# Altium project SingleChip-Rev2.PrjPcb (part 2 of 8)

## Sheet AWR2243_PMIC.SchDoc: =ProjectTitle
size A3; PageSetup: Record=PageOptions|CenterHorizontal=True|CenterVertical=True|PrintScale=1.00|XCorrection=1.00|YCorrection=1.00|PrintKind=0|BorderSize=5000000|LeftOffset=0|BottomOffset=0|Orientation=2|PaperLength=1000|PaperWidth=1000|Scale=100|PaperSource=15|PrintQuality=600|MediaType=1|DitherType=10|PaperKind=Letter|PrintScaleMode=1; Author: Jaime I. Chait; Organization: NWES LLC; Address1: 111 SW 5th Ave, STE 3150; Address2: Portland, OR 97204; DocumentNumber: SCH-0001; Revision: 2; SheetNumber: 9; SheetTotal: 19
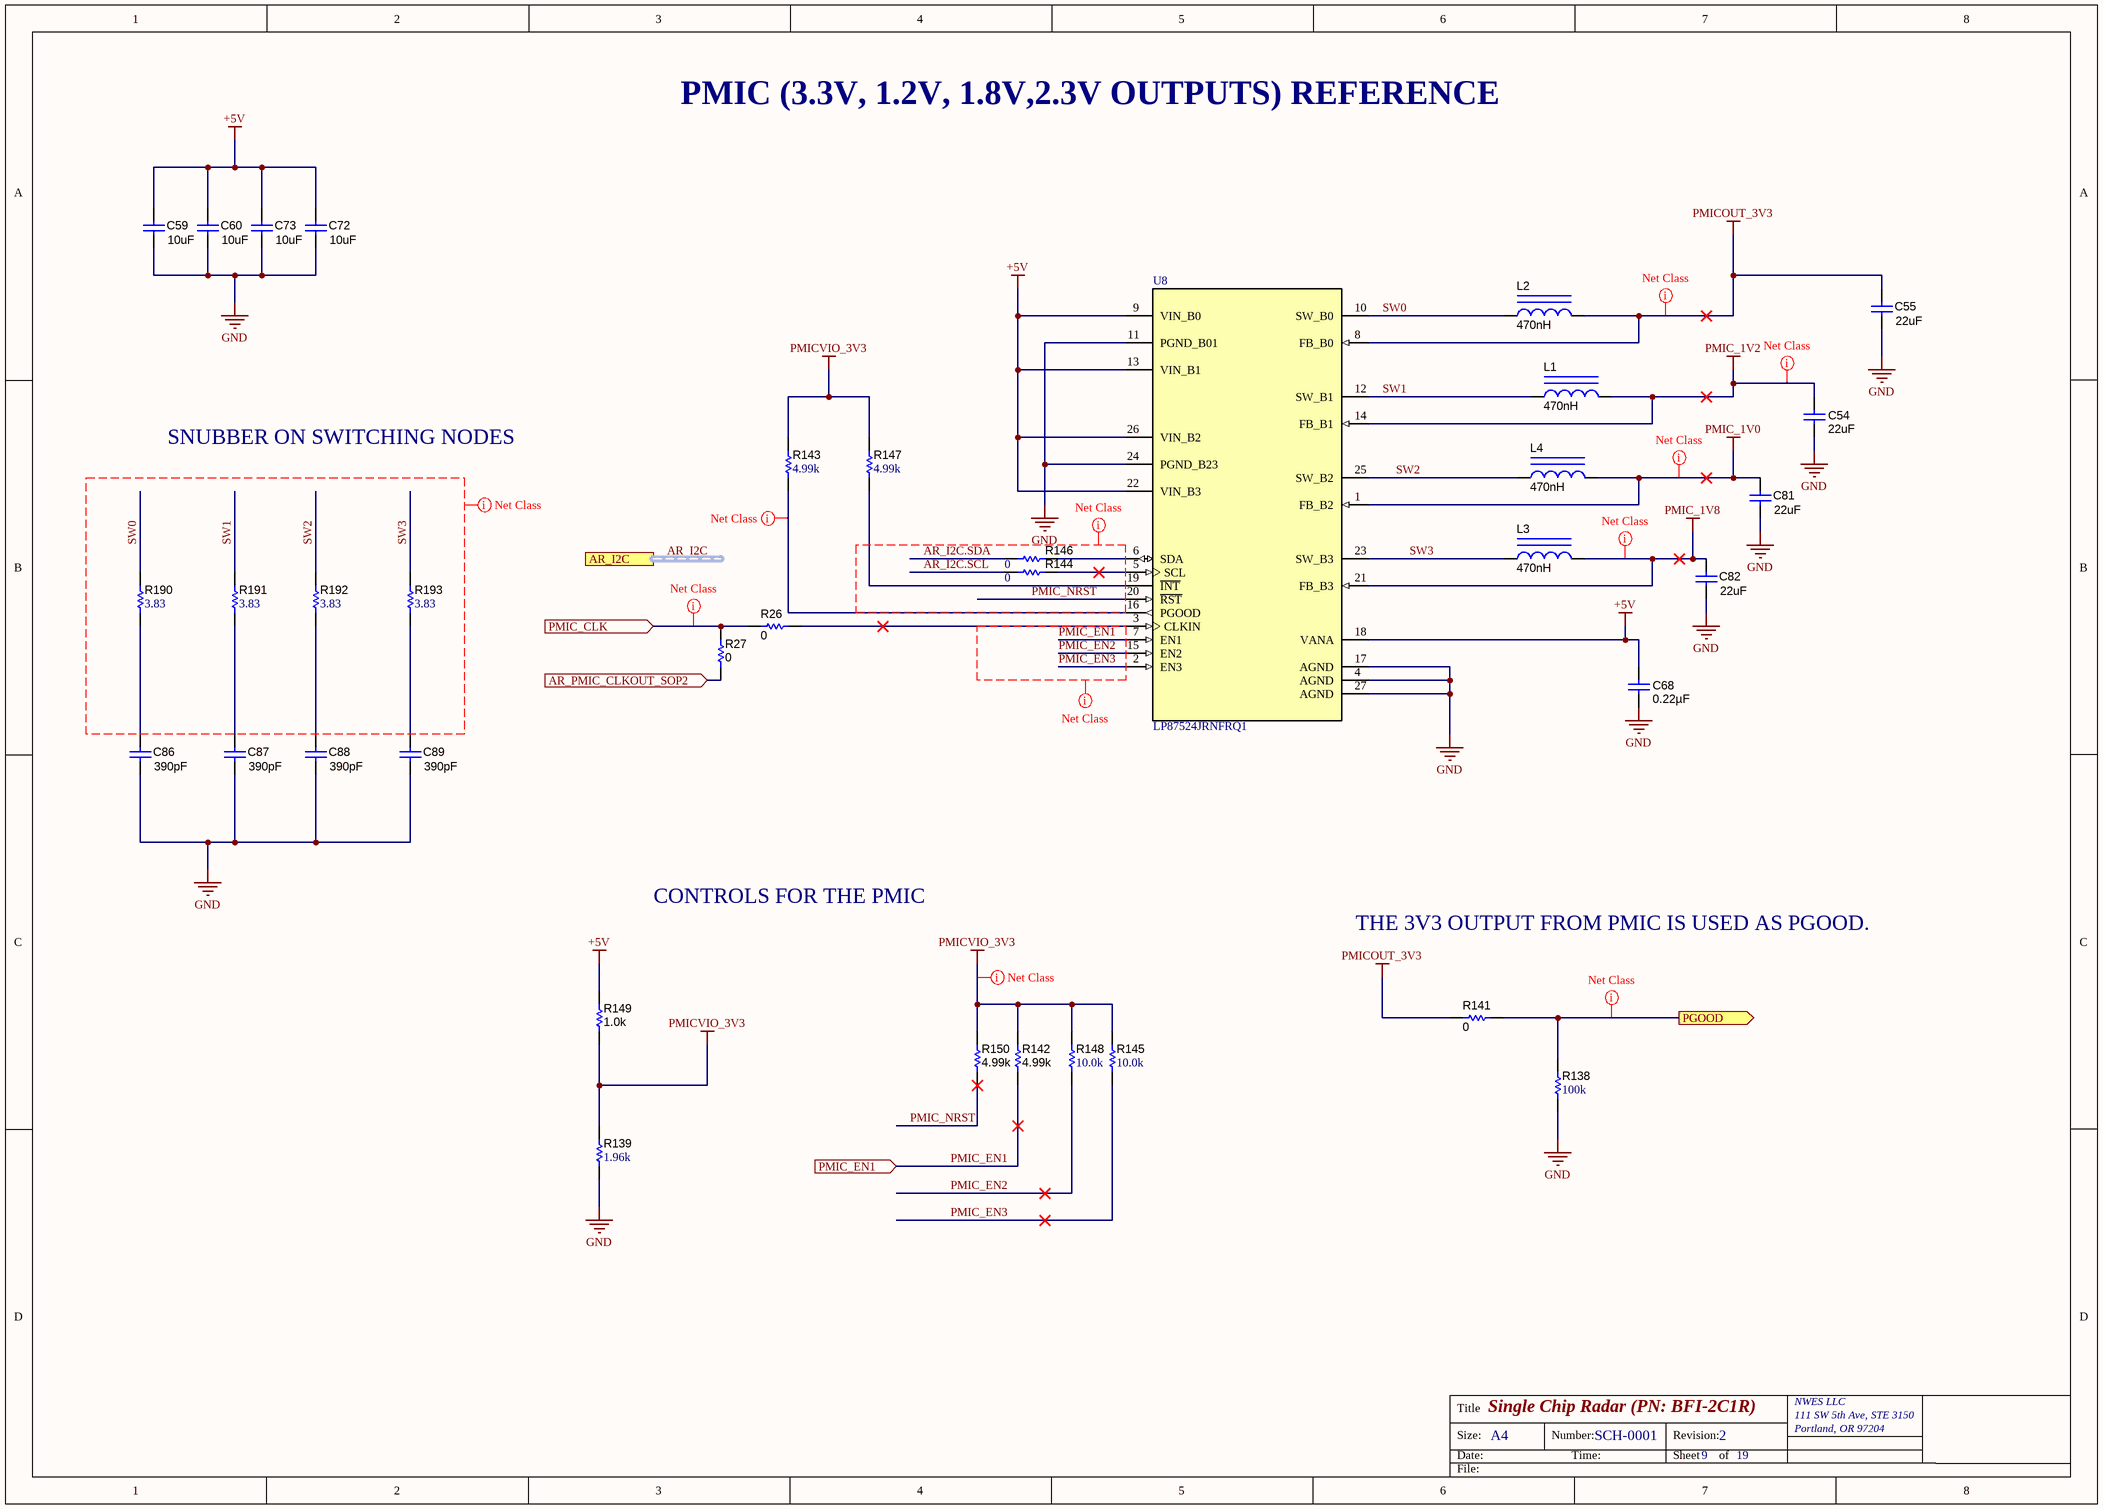
[diagram p6: AWR2243_PMIC.SchDoc]

### Parts
C54  ValueDisplayed: 22uF  [1206_180]  (hidden comment: GCM31CR71A226KE02)
C55  ValueDisplayed: 22uF  [1206_180]  (hidden comment: GCM31CR71A226KE02)
C59  ValueDisplayed: 10uF  [0805_HV1]  (hidden comment: GCM21BR71A106KE22L)
C60  ValueDisplayed: 10uF  [0805_HV1]  (hidden comment: GCM21BR71A106KE22L)
C68  ValueDisplayed: 0.22µF  [0402L]  (hidden comment: GCM155R71C224KE02D)
C72  ValueDisplayed: 10uF  [0805_HV1]  (hidden comment: GCM21BR71A106KE22L)
C73  ValueDisplayed: 10uF  [0805_HV1]  (hidden comment: GCM21BR71A106KE22L)
C81  ValueDisplayed: 22uF  [1206_180]  (hidden comment: GCM31CR71A226KE02)
C82  ValueDisplayed: 22uF  [1206_180]  (hidden comment: GCM31CR71A226KE02)
C86  ValueDisplayed: 390pF  [0402]  (hidden comment: GRM1555C1H391JA01D)
C87  ValueDisplayed: 390pF  [0402]  (hidden comment: GRM1555C1H391JA01D)
C88  ValueDisplayed: 390pF  [0402]  (hidden comment: GRM1555C1H391JA01D)
C89  ValueDisplayed: 390pF  [0402]  (hidden comment: GRM1555C1H391JA01D)
L1  ValueDisplayed: 470nH  [DFE252012P]  (hidden comment: DFE252012P-R47M=P2)
L2  ValueDisplayed: 470nH  [DFE252012P]  (hidden comment: DFE252012P-R47M=P2)
L3  ValueDisplayed: 470nH  [DFE252012P]  (hidden comment: DFE252012P-R47M=P2)
L4  ValueDisplayed: 470nH  [DFE252012P]  (hidden comment: DFE252012P-R47M=P2)
R26  ValueDisplayed: 0  [0402]  (hidden comment: ERJ-2GE0R00X)
R27  ValueDisplayed: 0  [0402]  (hidden comment: ERJ-2GE0R00X)
R138  ValueDisplayed: 100k  [0402L]  (hidden comment: CRCW0402100KFKED)
R139  ValueDisplayed: 1.96k  [0402L]  (hidden comment: CRCW04021K96FKED)
R141  ValueDisplayed: 0  [0402L]  (hidden comment: ERJ-2GE0R00X)
R142  ValueDisplayed: 4.99k  [0402L]  (hidden comment: ERJ-2RKF4991X)
R143  ValueDisplayed: 4.99k  [0402L]  (hidden comment: CRCW04024K99FKED)
R144  ValueDisplayed: 0  [0201_Silk]  (hidden comment: CRCW02010000Z0ED)
R145  ValueDisplayed: 10.0k  [0402L]  (hidden comment: CRCW040210K0FKED)
R146  ValueDisplayed: 0  [0201_Silk]  (hidden comment: CRCW02010000Z0ED)
R147  ValueDisplayed: 4.99k  [0402L]  (hidden comment: CRCW04024K99FKED)
R148  ValueDisplayed: 10.0k  [0402L]  (hidden comment: CRCW040210K0FKED)
R149  ValueDisplayed: 1.0k  [0402L]  (hidden comment: ERJ-2GEJ102X)
R150  ValueDisplayed: 4.99k  [0402L]  (hidden comment: ERJ-2RKF4991X)
R190  ValueDisplayed: 3.83  [0402L]  (hidden comment: CRCW04023R83FKED)
R191  ValueDisplayed: 3.83  [0402L]  (hidden comment: CRCW04023R83FKED)
R192  ValueDisplayed: 3.83  [0402L]  (hidden comment: CRCW04023R83FKED)
R193  ValueDisplayed: 3.83  [0402L]  (hidden comment: CRCW04023R83FKED)
U8  LP87524JRNFRQ1  [RNF0026C]

### Ports
AR_I2C (harness I2C), AR_PMIC_CLKOUT_SOP2 (in), PGOOD (out), PMIC_CLK (in), PMIC_EN1 (in)

### Nets
+5V: C59.2 C60.2 C68.2 C72.2 C73.2 R149.2 U8.9(VIN_B0) U8.13(VIN_B1) U8.18(VANA) U8.22(VIN_B3) U8.26(VIN_B2)
GND: C54.1 C55.1 C59.1 C60.1 C68.1 C72.1 C73.1 C81.1 C82.1 C86.2 C87.2 C88.2 C89.2 R138.1 R139.1 U8.4(AGND) U8.11(PGND_B01) U8.17(AGND) U8.24(PGND_B23) U8.27(AGND)
PMIC_1V0: C81.2 L4.2 U8.1(FB_B2)
PMIC_1V2: C54.2 L1.2 U8.14(FB_B1)
PMIC_1V8: C82.2 L3.2 U8.21(FB_B3)
PMICOUT_3V3: C55.2 L2.2 R141.1 U8.8(FB_B0)
PMICVIO_3V3: R139.2 R142.2 R143.2 R145.2 R147.2 R148.2 R149.1 R150.1
AR_I2C.SCL: R144.1
AR_I2C.SDA: R146.2
AR_PMIC_CLKOUT_SOP2: R27.2 ; port AR_PMIC_CLKOUT_SOP2
PGOOD: R138.2 R141.2 ; port PGOOD
PMIC_CLK: R26.1 R27.1 ; port PMIC_CLK
PMIC_EN1: R142.1 U8.7(EN1) ; port PMIC_EN1
PMIC_EN2: R148.1 U8.15(EN2)
PMIC_EN3: R145.1 U8.2(EN3)
PMIC_NRST: R150.2 U8.20(~{RST})
SW0: L2.1 R190.2 U8.10(SW_B0)
SW1: L1.1 R191.2 U8.12(SW_B1)
SW2: L4.1 R192.2 U8.25(SW_B2)
SW3: L3.1 R193.2 U8.23(SW_B3)
NetC86_1: C86.1 R190.1
NetC87_1: C87.1 R191.1
NetC88_1: C88.1 R192.1
NetC89_1: C89.1 R193.1
NetR26_2: R26.2 U8.3(CLKIN)
NetR143_1: R143.1 U8.16(PGOOD)
NetR144_2: R144.2 U8.5(SCL)
NetR146_1: R146.1 U8.6(SDA)
NetR147_1: R147.1 U8.19(~{INT})

### Buses and harness runs
harness AR_I2C = port AR_I2C

### Layout directives
net class PWR: PGOOD, PMIC_1V0, PMIC_1V2, PMIC_1V8, PMICOUT_3V3, PMICVIO_3V3
net class GENERAL: AR_I2C.SCL, AR_I2C.SDA, NetR143_1, PMIC_EN1, PMIC_EN2, PMIC_EN3, PMIC_NRST, SW0, SW1, SW2, SW3
net class CLK: PMIC_CLK

### Notes on the sheet
- PMIC (3.3V, 1.2V, 1.8V,2.3V OUTPUTS) REFERENCE
- SNUBBER ON SWITCHING NODES
- CONTROLS FOR THE PMIC
- THE 3V3 OUTPUT FROM PMIC IS USED AS PGOOD.
- Title
- Size:
- Date:
- A4
- Number:
- Time:
- Revision:
- Sheet
- of
- File:

### Library data of the parts
C54 = CMP-0008811-2: CAP, CERM, 22 uF, 10 V, +/- 10%, X7R, AEC-Q200 Grade 1, 1206; Manufacturer: MuRata; TaMin_C: -55°C; Polarized: N; SizeAreaWB_mm2: 10.92; Value1: Unknown; U/M: EA; Value: 22uF; TaMax_C: 125°C; SizeZ_mm: 1.8; SizeX_mm: 3.2; SizeY_mm: 1.6; Cap_Case: 1206; Value2: 10V; SizeArea_mm2: 5.12; CompType: Capacitor; AEC Qualified: Y; Cap_F: 22µF; AEC Grade: 1; AEC Category: Q200; Publisher: Texas Instruments; TempCo: X7R; Published: 2008-06-19; RoHS: Y; MountType: SMT; PackageReference: 1206; Tolerance_%: 10%; LatestRevisionDate: 2017-03-09; PartNumber: GCM31CR71A226KE02; VDC_V: 10V; ComponentLink1Description: Datasheet link; Technology: Ceramic; ComponentLink1URL: http://psearch.en.murata.com/capacitor/product/GCM31CR71A226KE02%23.pdf
C55 C81 C82 = CMP-0008811-2: CAP, CERM, 22 uF, 10 V, +/- 10%, X7R, AEC-Q200 Grade 1, 1206; Manufacturer: MuRata; TaMin_C: -55°C; Polarized: N; SizeAreaWB_mm2: 10.92; Value1: Unknown; U/M: EA; Value: 22uF; TaMax_C: 125°C; SizeZ_mm: 1.8; SizeX_mm: 3.2; SizeY_mm: 1.6; Cap_Case: 1206; Value2: 10V; SizeArea_mm2: 5.12; AEC Qualified: Y; Cap_F: 22µF; AEC Grade: 1; AEC Category: Q200; Publisher: Texas Instruments; TempCo: X7R; Published: 2008-06-19; RoHS: Y; MountType: SMT; PackageReference: 1206; Tolerance_%: 10%; CompType: Capacitor; LatestRevisionDate: 2017-03-09; PartNumber: GCM31CR71A226KE02; VDC_V: 10V; ComponentLink1Description: Datasheet link; Technology: Ceramic; ComponentLink1URL: http://psearch.en.murata.com/capacitor/product/GCM31CR71A226KE02%23.pdf
C59 C60 C72 C73 = CMP-0008017-2: CAP, CERM, 10 uF, 10 V, +/- 10%, X7R, 0805; Manufacturer: MuRata; TaMin_C: -55°C; Polarized: N; SizeAreaWB_mm2: 6.75; Value1: Unknown; U/M: EA; Value: 10uF; TaMax_C: 125°C; SizeZ_mm: 1.45; SizeX_mm: 2; SizeY_mm: 1.25; Cap_Case: 0805; Value2: 10V; SizeArea_mm2: 2.5; CompType: Capacitor; Cap_F: 10µF; AEC Category: Q200; Supplier Part Number 2: 06AC6014; Publisher: Texas Instruments; Supplier 2: Newark; Supplier Part Number 3: 81-GCM21BR71A106KE2L; TempCo: X7R; Supplier 3: Mouser; Published: 2008-06-19; RoHS: Y; MountType: SMT; Supplier 1: Digi-Key; PackageReference: 0805; Tolerance_%: 10%; LatestRevisionDate: 2017-03-09; PartNumber: GCM21BR71A106KE22L; AEC Qualified: ?; VDC_V: 10V; ComponentLink1Description: Datasheet link; Supplier Part Number 1: 490-10674-1-ND; Technology: Ceramic; ComponentLink1URL: http://www.murata.com/products/catalog/pdf/c03e.pdf
C68 = CMP-0078265-1: CAP, CERM, 0.22 µF, 16 V,+/- 10%, X7R, AEC-Q200 Grade 1, 0402; Manufacturer: MuRata; TaMin_C: -55°C; Polarized: N; SizeAreaWB_mm2: 3; U/M: EA; Value: 0.22uF; TaMax_C: 125°C; SizeZ_mm: 0.6; SizeX_mm: 1; SizeY_mm: 0.5; Cap_Case: 0402; Value2: 16V; CompType: Capacitor; AEC Qualified: Y; Cap_F: 220nF; AEC Category: Q200; ComponentLink1URL: http://psearch.en.murata.com/capacitor/product/GCM155R71C224KE02%23.pdf; Supplier Part Number 2: 81-GCM155R71C224KE2D; Supplier 2: Mouser; TempCo: X7R; RoHS: Y; MountType: SMT; Supplier 1: Digi-Key; PackageReference: 0402; Tolerance_%: 10%; SizeArea_mm2: 0.5; PartNumber: GCM155R71C224KE02D; VDC_V: 16V; ComponentLink1Description: Datasheet link; AEC Grade: 1; Supplier Part Number 1: 490-10671-1-ND; Technology: Ceramic
C86-C89 = CMP-0006459-1: CAP, CERM, 390 pF, 50 V, +/- 5%, C0G/NP0, 0402; Manufacturer: MuRata; TaMin_C: -55°C; Polarized: N; SizeAreaWB_mm2: 3; Value1: Unknown; U/M: EA; Value: 390pF; TaMax_C: 125°C; SizeZ_mm: 0.6; SizeX_mm: 1; SizeY_mm: 0.5; Value2: 50V; AEC Category: Q200; ComponentLink1URL: http://search.murata.co.jp/Ceramy/PnsearchViewAction.do?HnOFG=ON&HnNFG=ON&SEL_CNT=50&sLang=en&sKey=GRM1555C1H391JA01D&x=9&y=9&search=startwith; Supplier Part Number 2: 81-GRM1555C1H391JA01; Publisher: Texas Instruments; Supplier 2: Mouser; TempCo: C0G/NP0; Published: 2008-06-19; RoHS: Y; MountType: SMT; Supplier 1: Digi-Key; PackageReference: 0402; Tolerance_%: 5%; Cap_Case: 0402; SizeArea_mm2: 0.5; CompType: Capacitor; LatestRevisionDate: 2017-03-09; PartNumber: GRM1555C1H391JA01D; AEC Qualified: ?; Cap_F: 390pF; VDC_V: 50V; ComponentLink1Description: Datasheet link; Supplier Part Number 1: 490-1296-1-ND; Technology: Ceramic
L1-L4 = CMP-0058946-1: Inductor, Shielded, 470 nH, 4.7 A, 0.021 ohm, SMD; Manufacturer: MuRata Toko; Isat: 6.4A @ 30% inductance drop; Irms: 4.7A @ 40C rise; SizeAreaWB_mm2: 10.5; DCR_ohm: 0.021; Value: 470nH; Imax_A: 4.7A; SizeZ_mm: 1.2; SizeX_mm: 2.5; SizeY_mm: 2; SizeArea_mm2: 5; AEC Category: Q200; ComponentLink1URL: http://www.toko.co.jp/products/pdf/inductors/dfe252012p.pdf; Publisher: Texas Instruments; Published: 2008-06-26; RoHS: Y; Value1: 0.021 ohm; Material: ?; MountType: SMT; PackageReference: 1008; Value2: 4.7A; CompType: Inductor; Ind_H: 470nH; LatestRevisionDate: 2017-06-02; PartNumber: DFE252012P-R47M=P2; AEC Qualified: ?; ComponentLink1Description: Datasheet link; Technology: Shielded
R26 R27 = CMP-0026992-2: RES, 0, 5%, 0.063 W, 0402; Manufacturer: Panasonic; Power_W: 63mW; TempCo: 600 ppm/C; Value_Code: 0000; U/M: EA; Value: 0; EIA_Code: E24; SizeX_mm: 1; SizeY_mm: 0.5; SizeZ_mm: 0.6; Value2: 0.063W; CompType: Resistor; VDC_V: 50V; AEC Category: Q200; INSTALATION: DNP; Supplier Part Number 2: 65T8307; Publisher: Texas Instruments; Supplier 2: Newark; Supplier Part Number 3: 667-ERJ-2GE0R00X; Supplier 3: Mouser; Published: 2008-06-26; RoHS: Y; Value1: 5%; MountType: SMT; Supplier 1: Digi-Key; PackageReference: 0402; Tolerance_%: 5%; Res_ohm: 0; SizeArea_mm2: 0.5; LatestRevisionDate: 2017-03-09; PartNumber: ERJ-2GE0R00X; AEC Qualified: ?; ComponentLink1Description: Datasheet link; Supplier Part Number 1: P0.0JCT-ND; Technology: Thick Film; ComponentLink1URL: http://www.panasonic.com/industrial/components/pdf/AOA0000CE1.pdf
R138 = CMP-0025950-3: RES, 100 k, 1%, 0.063 W, AEC-Q200 Grade 0, 0402; Manufacturer: Vishay-Dale; Power_W: 63mW; TempCo: 100 ppm/C; Value: 100k; EIA_Code: E96; SizeX_mm: 1; SizeY_mm: 0.5; SizeZ_mm: 0.6; Value2: 0.063W; AEC Qualified: Y; VDC_V: 50V; AEC Category: Q200; AEC Grade: 0; Supplier Part Number 2: 52K6607; Supplier 2: Newark; Supplier Part Number 3: 71-CRCW0402-100K-E3; Supplier 3: Mouser; Value_Code: 100k; RoHS: E; Value1: 1%; MountType: SMT; Supplier 1: Digi-Key; PackageReference: 0402; Tolerance_%: 1%; Res_ohm: 100k; SizeArea_mm2: 0.5; CompType: Resistor; PartNumber: CRCW0402100KFKED; ComponentLink1Description: Datasheet link; Supplier Part Number 1: 541-100KLCT-ND; Technology: Thick Film; ComponentLink1URL: http://www.vishay.com/docs/20035/dcrcwe3.pdf
R139 = CMP-0026099-2: RES, 1.96 k, 1%, 0.063 W, AEC-Q200 Grade 0, 0402; Manufacturer: Vishay-Dale; Power_W: 63mW; TempCo: 100 ppm/C; Value_Code: 1k96; Value: 1.96k; EIA_Code: E96; SizeX_mm: 1; SizeY_mm: 0.5; SizeZ_mm: 0.6; Value2: 0.063W; AEC Qualified: Y; VDC_V: 50V; AEC Category: Q200; AEC Grade: 0; ComponentLink1URL: http://www.vishay.com/docs/20035/dcrcwe3.pdf; Supplier Part Number 2: 52K6592; Supplier 2: Newark; Supplier Part Number 3: 71-CRCW0402-1.96K-E3; Supplier 3: Mouser; RoHS: E; Value1: 1%; MountType: SMT; Supplier 1: Digi-Key; PackageReference: 0402; Tolerance_%: 1%; Res_ohm: 1.96k; SizeArea_mm2: 0.5; CompType: Resistor; PartNumber: CRCW04021K96FKED; ComponentLink1Description: Datasheet link; Supplier Part Number 1: 541-1.96KLCT-ND; Technology: Thick Film
R141 = CMP-0026992-2: RES, 0, 5%, 0.063 W, 0402; Manufacturer: Panasonic; Power_W: 63mW; TempCo: 600 ppm/C; Value_Code: 0000; U/M: EA; Value: 0; EIA_Code: E24; SizeX_mm: 1; SizeY_mm: 0.5; SizeZ_mm: 0.6; Value2: 0.063W; VDC_V: 50V; AEC Category: Q200; Supplier Part Number 2: 65T8307; Publisher: Texas Instruments; Supplier 2: Newark; Supplier Part Number 3: 667-ERJ-2GE0R00X; Supplier 3: Mouser; Published: 2008-06-26; RoHS: Y; Value1: 5%; MountType: SMT; Supplier 1: Digi-Key; PackageReference: 0402; Tolerance_%: 5%; Res_ohm: 0; SizeArea_mm2: 0.5; CompType: Resistor; LatestRevisionDate: 2017-03-09; PartNumber: ERJ-2GE0R00X; AEC Qualified: ?; ComponentLink1Description: Datasheet link; Supplier Part Number 1: P0.0JCT-ND; Technology: Thick Film; ComponentLink1URL: http://www.panasonic.com/industrial/components/pdf/AOA0000CE1.pdf
R142 R150 = CMP-0026701-1: RES, 4.99 k, 1%, 0.1 W, AEC-Q200 Grade 0, 0402; Manufacturer: Panasonic; Power_W: 100mW; TempCo: 100 ppm/C; Value_Code: 4k99; U/M: EA; Value: 4.99k; EIA_Code: E96; SizeX_mm: 1; SizeY_mm: 0.5; SizeZ_mm: 0.6; Value2: 0.1W; AEC Qualified: Y; VDC_V: 50V; AEC Grade: 0; AEC Category: Q200; ComponentLink1URL: http://industrial.panasonic.com/cdbs/www-data/pdf/RDA0000/AOA0000C86.pdf; Supplier Part Number 2: 73T6529; Publisher: Texas Instruments; Supplier 2: Newark; Supplier Part Number 3: 667-ERJ-2RKF4991X; Supplier 3: Mouser; Published: 2008-06-26; RoHS: Y; Value1: 1%; MountType: SMT; Supplier 1: Digi-Key; PackageReference: 0402; Tolerance_%: 1%; Res_ohm: 4.99k; SizeArea_mm2: 0.5; CompType: Resistor; LatestRevisionDate: 2017-03-09; PartNumber: ERJ-2RKF4991X; ComponentLink1Description: Datasheet link; Supplier Part Number 1: P4.99KLCT-ND; Technology: Thick Film
R143 R147 = CMP-0026414-2: RES, 4.99 k, 1%, 0.063 W, AEC-Q200 Grade 0, 0402; Manufacturer: Vishay-Dale; Power_W: 63mW; TempCo: 100 ppm/C; Value_Code: 4k99; Value: 4.99k; EIA_Code: E96; SizeX_mm: 1; SizeY_mm: 0.5; SizeZ_mm: 0.6; Value2: 0.063W; AEC Qualified: Y; VDC_V: 50V; AEC Category: Q200; AEC Grade: 0; ComponentLink1URL: http://www.vishay.com/docs/20035/dcrcwe3.pdf; Supplier Part Number 2: 52K7048; Supplier 2: Newark; Supplier Part Number 3: 71-CRCW0402-4.99K-E3; Supplier 3: Mouser; RoHS: E; Value1: 1%; MountType: SMT; Supplier 1: Digi-Key; PackageReference: 0402; Tolerance_%: 1%; Res_ohm: 4.99k; SizeArea_mm2: 0.5; CompType: Resistor; PartNumber: CRCW04024K99FKED; ComponentLink1Description: Datasheet link; Supplier Part Number 1: 541-4.99KLCT-ND; Technology: Thick Film
R144 R146 = CMP-0027008-4: RES, 0, 5%, 0.05 W, 0201; Manufacturer: Vishay-Dale; Power_W: 50mW; TempCo: ppm/C; Value_Code: 0000; Value: 0; EIA_Code: E24; SizeX_mm: 0.6; SizeY_mm: 0.3; SizeZ_mm: 0.26; Value2: 0.05W; SizeArea_mm2: 0.18; AEC Qualified: N; AEC Category: Q200; RoHS: E; Value1: 5%; MountType: SMT; Supplier 1: Newark; PackageReference: 0201; Tolerance_%: 5%; Res_ohm: 0; CompType: Resistor; PartNumber: CRCW02010000Z0ED; ComponentLink1Description: Datasheet link; AEC Grade: N/A; Supplier Part Number 1: 72M6743; Technology: Thick Film; ComponentLink1URL: http://www.vishay.com/docs/20052/crcw0201e3.pdf
R145 = CMP-0025958-3: RES, 10.0 k, 1%, 0.063 W, AEC-Q200 Grade 0, 0402; Manufacturer: Vishay-Dale; Power_W: 63mW; TempCo: 100 ppm/C; Value_Code: 10k0; Value: 10.0k; EIA_Code: E96; Res_ohm: 10k; SizeX_mm: 1; SizeY_mm: 0.5; SizeZ_mm: 0.6; Value2: 0.063W; CompType: Resistor; AEC Qualified: Y; VDC_V: 50V; AEC Category: Q200; AEC Grade: 0; Supplier Part Number 2: 52K6595; Supplier 2: Newark; Supplier Part Number 3: 71-CRCW0402-10K-E3; Supplier 3: Mouser; RoHS: E; Value1: 1%; MountType: SMT; Supplier 1: Digi-Key; PackageReference: 0402; Tolerance_%: 1%; SizeArea_mm2: 0.5; PartNumber: CRCW040210K0FKED; ComponentLink1Description: Datasheet link; Supplier Part Number 1: 541-10.0KLCT-ND; Technology: Thick Film; ComponentLink1URL: http://www.vishay.com/docs/20035/dcrcwe3.pdf
R148 = CMP-0025958-3: RES, 10.0 k, 1%, 0.063 W, AEC-Q200 Grade 0, 0402; Manufacturer: Vishay-Dale; Power_W: 63mW; TempCo: 100 ppm/C; Value_Code: 10k0; Value: 10.0k; EIA_Code: E96; Res_ohm: 10k; SizeX_mm: 1; SizeY_mm: 0.5; SizeZ_mm: 0.6; Value2: 0.063W; AEC Qualified: Y; VDC_V: 50V; AEC Category: Q200; AEC Grade: 0; Supplier Part Number 2: 52K6595; Supplier 2: Newark; Supplier Part Number 3: 71-CRCW0402-10K-E3; Supplier 3: Mouser; RoHS: E; Value1: 1%; MountType: SMT; Supplier 1: Digi-Key; PackageReference: 0402; Tolerance_%: 1%; SizeArea_mm2: 0.5; CompType: Resistor; PartNumber: CRCW040210K0FKED; ComponentLink1Description: Datasheet link; Supplier Part Number 1: 541-10.0KLCT-ND; Technology: Thick Film; ComponentLink1URL: http://www.vishay.com/docs/20035/dcrcwe3.pdf
R149 = CMP-0078193-1: RES, 1.0 k, 5%, 0.1 W, AEC-Q200 Grade 0, 0402; Manufacturer: Panasonic; Value_Code: 1k00; SizeArea_mm2: 0.5; AEC Qualified: Y; AEC Category: Q200; Res_ohm: 1k; Value: 1.0k; SizeZ_mm: 0.6; Green_REACh: Passed; EIA_Code: E24; TempCo: 200 ppm/C; AEC Grade: 0; Power_W: 100mW; VDC_V: 50V; Value2: 0.1W; Green_Lifecycle: Active; U/M: EA; SizeX_mm: 1; ComponentLink1Description: Datasheet link; RoHS: Y; Supplier Part Number 3: 667-ERJ-2GEJ102X; Tolerance_%: 5%; Supplier 1: Digi-Key; Green_EU RoHS: Passed with Exemption; PackageReference: 0402; Technology: Thick Film; PartNumber: ERJ-2GEJ102X; Supplier Part Number 2: 65T8247; Supplier 2: Newark; SizeY_mm: 0.5; ComponentLink1URL: https://industrial.panasonic.com/cdbs/www-data/pdf/RDA0000/DMA0000COL9.pdf; Value1: 5%; CompType: Resistor; MountType: SMT; Supplier Part Number 1: P1.0KJCT-ND; Supplier 3: Mouser; Green_EU RoHS-2: Passed
R190-R193 = CMP-0026363-2: RES, 3.83, 1%, 0.063 W, AEC-Q200 Grade 0, 0402; Manufacturer: Vishay-Dale; Power_W: 63mW; TempCo: 100 ppm/C; Value_Code: 3R83; Value: 3.83; EIA_Code: E96; SizeX_mm: 1; SizeY_mm: 0.5; SizeZ_mm: 0.6; Value2: 0.063W; AEC Qualified: Y; VDC_V: 50V; AEC Category: Q200; AEC Grade: 0; ComponentLink1URL: http://www.vishay.com/docs/20035/dcrcwe3.pdf; Supplier Part Number 2: 71-CRCW04023R83FKED; Supplier 2: Mouser; RoHS: E; Value1: 1%; MountType: SMT; Supplier 1: Digi-Key; PackageReference: 0402; Tolerance_%: 1%; Res_ohm: 3.83; SizeArea_mm2: 0.5; CompType: Resistor; PartNumber: CRCW04023R83FKED; ComponentLink1Description: Datasheet link; Supplier Part Number 1: 541-3.83LLCT-ND; Technology: Thick Film
U8 = CMP-0079120-1: 4-A + 2.5-A + Two 1.5-A Buck Converters With Integrated Switches, RNF0026C (VQFN-HR-26); Alternate PartNumber: LP87524JRNFTQ1; Alternate Manufacturer: Texas Instruments; SizeAreaWB_mm2: 27.5; SizeZ_mm: 0.9; SizeX_mm: 4; SizeY_mm: 4.5; SizeArea_mm2: 18; CompType: IC; AEC Qualified: Y; AEC Category: Q200; ComponentLink1URL: http://www.ti.com/lit/ds/symlink/lp87524-q1.pdf; PackageDescription: VQFN-HR-26; RoHS: Y; MountType: SMT; ComponentLink2URL: http://www.ti.com/product/lp87524-q1; ComponentLink2Description: Product Folder; Manufacturer: Texas Instruments; PackageReference: RNF0026C; PartNumber: LP87524JRNFRQ1; ComponentLink1Description: Datasheet Link

## Sheet DDR4.SchDoc: =ProjectTitle
size A3; Author: Jaime I. Chait; Organization: NWES LLC; Address1: 111 SW 5th Ave, STE 3150; Address2: Portland, OR 97204; DocumentNumber: SCH-0001; Revision: 2; SheetNumber: 12; SheetTotal: 19
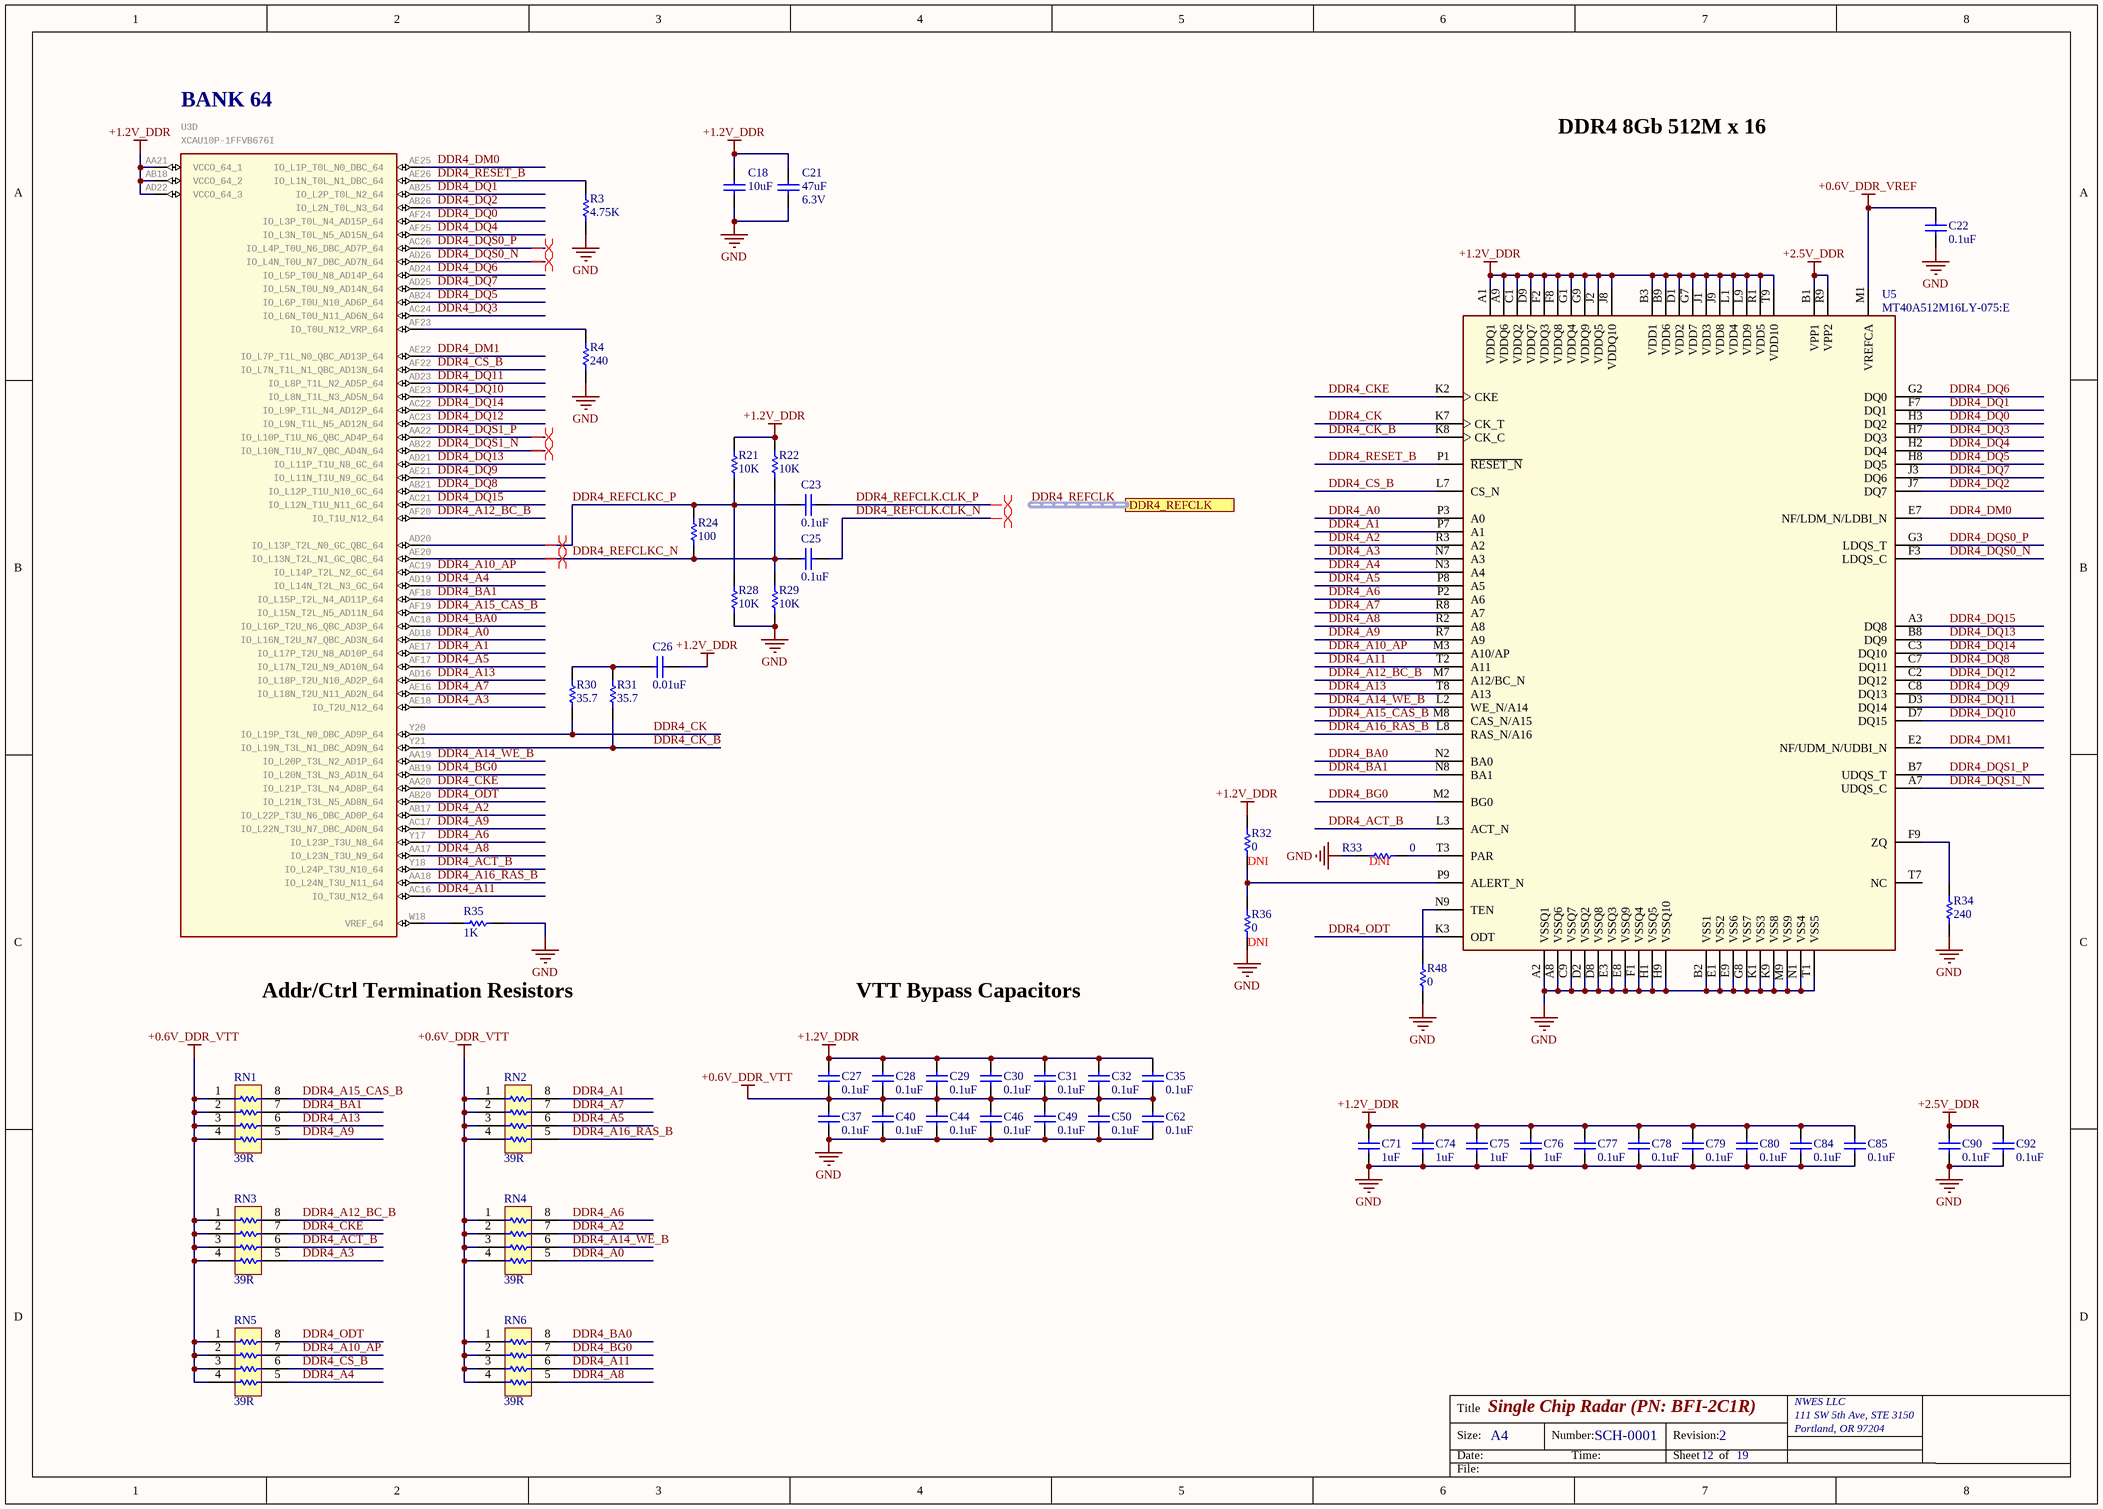
[diagram p7: DDR4.SchDoc]

### Parts
C18  10uF  [CAPC1005X90]
C21  47uF  Voltage Rating: 6.3V  [CAP-1206]
C22  0.1uF  [CAPC1005X55USR]
C23  0.1uF  [CAPC1005X55USR]
C25  0.1uF  [CAPC1005X55USR]
C26  0.01uF  [CAPC1005X55USR]
C27  0.1uF  [CAPC1005X55USR]
C28  0.1uF  [CAPC1005X55USR]
C29  0.1uF  [CAPC1005X55USR]
C30  0.1uF  [CAPC1005X55USR]
C31  0.1uF  [CAPC1005X55USR]
C32  0.1uF  [CAPC1005X55USR]
C35  0.1uF  [CAPC1005X55USR]
C37  0.1uF  [CAPC1005X55USR]
C40  0.1uF  [CAPC1005X55USR]
C44  0.1uF  [CAPC1005X55USR]
C46  0.1uF  [CAPC1005X55USR]
C49  0.1uF  [CAPC1005X55USR]
C50  0.1uF  [CAPC1005X55USR]
C62  0.1uF  [CAPC1005X55USR]
C71  1uF  [CAPC1005X55USR]
C74  1uF  [CAPC1005X55USR]
C75  1uF  [CAPC1005X55USR]
C76  1uF  [CAPC1005X55USR]
C77  0.1uF  [CAPC1005X55USR]
C78  0.1uF  [CAPC1005X55USR]
C79  0.1uF  [CAPC1005X55USR]
C80  0.1uF  [CAPC1005X55USR]
C84  0.1uF  [CAPC1005X55USR]
C85  0.1uF  [CAPC1005X55USR]
C90  0.1uF  [CAPC1005X55USR]
C92  0.1uF  [CAPC1005X55USR]
R3  4.75K  [RESC1005X40USR]
R4  240  [RESC1005X40USR]
R21  10K  [RESC1005X40USR]
R22  10K  [RESC1005X40USR]
R24  100  [RESC1005X40USR]
R28  10K  [RESC1005X40USR]
R29  10K  [RESC1005X40USR]
R30  35.7  [RESC1005X40USR]
R31  35.7  [RESC1005X40USR]
R32  0  [RESC1005X40USR]
R33  0  [RESC1005X40USR]
R34  240  [RESC1005X40USR]
R35  1K  [RESC1005X40USR]
R36  0  [RESC1005X40USR]
R48  0  [RESC1005X40USR]
RN1  39R  [RESCAXS50P100X200X45-8NA]
RN2  39R  [RESCAXS50P100X200X45-8NA]
RN3  39R  [RESCAXS50P100X200X45-8NA]
RN4  39R  [RESCAXS50P100X200X45-8NA]
RN5  39R  [RESCAXS50P100X200X45-8NA]
RN6  39R  [RESCAXS50P100X200X45-8NA]
U3  XCAU10P-1FFVB676I  [676-FCBGA (27x27)]  (part D of 16)
U5  MT40A512M16LY-075:E  [BGA96C80P6X16_1350X750X110]

### Ports
DDR4_REFCLK (harness DIFF_CLK)

### Nets
+0.6V_DDR_VREF: C22.2 U5.M1(VREFCA)
+0.6V_DDR_VTT: C27.1 C28.1 C29.1 C30.1 C31.1 C32.1 C35.1 C37.2 C40.2 C44.2 C46.2 C49.2 C50.2 C62.2 RN1.1 RN1.2 RN1.3 RN1.4 RN2.1 RN2.2 RN2.3 RN2.4 RN3.1 RN3.2 RN3.3 RN3.4 RN4.1 RN4.2 RN4.3 RN4.4 RN5.1 RN5.2 RN5.3 RN5.4 RN6.1 RN6.2 RN6.3 RN6.4
+1.2V_DDR: C18.2 C21.1 C26.2 C27.2 C28.2 C29.2 C30.2 C31.2 C32.2 C35.2 C71.2 C74.2 C75.2 C76.2 C77.2 C78.2 C79.2 C80.2 C84.2 C85.2 R21.2 R22.2 R32.1 U3.AA21(VCCO_64_1) U3.AB18(VCCO_64_2) U3.AD22(VCCO_64_3) U5.A1(VDDQ1) U5.A9(VDDQ6) U5.B3(VDD1) U5.B9(VDD6) U5.C1(VDDQ2) U5.D1(VDD2) U5.D9(VDDQ7) U5.F2(VDDQ3) U5.F8(VDDQ8) U5.G1(VDDQ4) U5.G7(VDD7) U5.G9(VDDQ9) U5.J1(VDD3) U5.J2(VDDQ5) U5.J8(VDDQ10) U5.J9(VDD8) U5.L1(VDD4) U5.L9(VDD9) U5.R1(VDD5) U5.T9(VDD10)
+2.5V_DDR: C90.2 C92.2 U5.B1(VPP1) U5.R9(VPP2)
GND: C18.1 C21.2 C22.1 C37.1 C40.1 C44.1 C46.1 C49.1 C50.1 C62.1 C71.1 C74.1 C75.1 C76.1 C77.1 C78.1 C79.1 C80.1 C84.1 C85.1 C90.1 C92.1 R3.1 R4.1 R28.1 R29.1 R33.2 R34.1 R35.2 R36.2 R48.1 U5.A2(VSSQ1) U5.A8(VSSQ6) U5.B2(VSS1) U5.C9(VSSQ7) U5.D2(VSSQ2) U5.D8(VSSQ8) U5.E1(VSS2) U5.E3(VSSQ3) U5.E8(VSSQ9) U5.E9(VSS6) U5.F1(VSSQ4) U5.G8(VSS7) U5.H1(VSSQ5) U5.H9(VSSQ10) U5.K1(VSS3) U5.K9(VSS8) U5.M9(VSS9) U5.N1(VSS4) U5.T1(VSS5)
DDR4_A0: RN4.5 U3.AD18(IO_L16N_T2U_N7_QBC_AD3N_64) U5.P3(A0)
DDR4_A1: RN2.8 U3.AE17(IO_L17P_T2U_N8_AD10P_64) U5.P7(A1)
DDR4_A2: RN4.7 U3.AB17(IO_L22P_T3U_N6_DBC_AD0P_64) U5.R3(A2)
DDR4_A3: RN3.5 U3.AE18(IO_T2U_N12_64) U5.N7(A3)
DDR4_A4: RN5.5 U3.AD19(IO_L14N_T2L_N3_GC_64) U5.N3(A4)
DDR4_A5: RN2.6 U3.AF17(IO_L17N_T2U_N9_AD10N_64) U5.P8(A5)
DDR4_A6: RN4.8 U3.Y17(IO_L23P_T3U_N8_64) U5.P2(A6)
DDR4_A7: RN2.7 U3.AE16(IO_L18N_T2U_N11_AD2N_64) U5.R8(A7)
DDR4_A8: RN6.5 U3.AA17(IO_L23N_T3U_N9_64) U5.R2(A8)
DDR4_A9: RN1.5 U3.AC17(IO_L22N_T3U_N7_DBC_AD0N_64) U5.R7(A9)
DDR4_A10_AP: RN5.7 U3.AC19(IO_L14P_T2L_N2_GC_64) U5.M3(A10/AP)
DDR4_A11: RN6.6 U3.AC16(IO_T3U_N12_64) U5.T2(A11)
DDR4_A12_BC_B: RN3.8 U3.AF20(IO_T1U_N12_64) U5.M7(A12/BC_N)
DDR4_A13: RN1.6 U3.AD16(IO_L18P_T2U_N10_AD2P_64) U5.T8(A13)
DDR4_A14_WE_B: RN4.6 U3.AA19(IO_L20P_T3L_N2_AD1P_64) U5.L2(WE_N/A14)
DDR4_A15_CAS_B: RN1.8 U3.AF19(IO_L15N_T2L_N5_AD11N_64) U5.M8(CAS_N/A15)
DDR4_A16_RAS_B: RN2.5 U3.AA18(IO_L24N_T3U_N11_64) U5.L8(RAS_N/A16)
DDR4_ACT_B: RN3.6 U3.Y18(IO_L24P_T3U_N10_64) U5.L3(ACT_N)
DDR4_BA0: RN6.8 U3.AC18(IO_L16P_T2U_N6_QBC_AD3P_64) U5.N2(BA0)
DDR4_BA1: RN1.7 U3.AF18(IO_L15P_T2L_N4_AD11P_64) U5.N8(BA1)
DDR4_BG0: RN6.7 U3.AB19(IO_L20N_T3L_N3_AD1N_64) U5.M2(BG0)
DDR4_CK: R30.1 U3.Y20(IO_L19P_T3L_N0_DBC_AD9P_64) U5.K7(CK_T)
DDR4_CK_B: R31.1 U3.Y21(IO_L19N_T3L_N1_DBC_AD9N_64) U5.K8(CK_C)
DDR4_CKE: RN3.7 U3.AA20(IO_L21P_T3L_N4_AD8P_64) U5.K2(CKE)
DDR4_CS_B: RN5.6 U3.AF22(IO_L7N_T1L_N1_QBC_AD13N_64) U5.L7(CS_N)
DDR4_DM0: U3.AE25(IO_L1P_T0L_N0_DBC_64) U5.E7(NF/LDM_N/LDBI_N)
DDR4_DM1: U3.AE22(IO_L7P_T1L_N0_QBC_AD13P_64) U5.E2(NF/UDM_N/UDBI_N)
DDR4_DQ0: U3.AF24(IO_L3P_T0L_N4_AD15P_64) U5.H3(DQ2)
DDR4_DQ1: U3.AB25(IO_L2P_T0L_N2_64) U5.F7(DQ1)
DDR4_DQ2: U3.AB26(IO_L2N_T0L_N3_64) U5.J7(DQ7)
DDR4_DQ3: U3.AC24(IO_L6N_T0U_N11_AD6N_64) U5.H7(DQ3)
DDR4_DQ4: U3.AF25(IO_L3N_T0L_N5_AD15N_64) U5.H2(DQ4)
DDR4_DQ5: U3.AB24(IO_L6P_T0U_N10_AD6P_64) U5.H8(DQ5)
DDR4_DQ6: U3.AD24(IO_L5P_T0U_N8_AD14P_64) U5.G2(DQ0)
DDR4_DQ7: U3.AD25(IO_L5N_T0U_N9_AD14N_64) U5.J3(DQ6)
DDR4_DQ8: U3.AB21(IO_L12P_T1U_N10_GC_64) U5.C7(DQ11)
DDR4_DQ9: U3.AE21(IO_L11N_T1U_N9_GC_64) U5.C8(DQ13)
DDR4_DQ10: U3.AE23(IO_L8N_T1L_N3_AD5N_64) U5.D7(DQ15)
DDR4_DQ11: U3.AD23(IO_L8P_T1L_N2_AD5P_64) U5.D3(DQ14)
DDR4_DQ12: U3.AC23(IO_L9N_T1L_N5_AD12N_64) U5.C2(DQ12)
DDR4_DQ13: U3.AD21(IO_L11P_T1U_N8_GC_64) U5.B8(DQ9)
DDR4_DQ14: U3.AC22(IO_L9P_T1L_N4_AD12P_64) U5.C3(DQ10)
DDR4_DQ15: U3.AC21(IO_L12N_T1U_N11_GC_64) U5.A3(DQ8)
DDR4_DQS0_N: U3.AD26(IO_L4N_T0U_N7_DBC_AD7N_64) U5.F3(LDQS_C)
DDR4_DQS0_P: U3.AC26(IO_L4P_T0U_N6_DBC_AD7P_64) U5.G3(LDQS_T)
DDR4_DQS1_N: U3.AB22(IO_L10N_T1U_N7_QBC_AD4N_64) U5.A7(UDQS_C)
DDR4_DQS1_P: U3.AA22(IO_L10P_T1U_N6_QBC_AD4P_64) U5.B7(UDQS_T)
DDR4_ODT: RN5.8 U3.AB20(IO_L21N_T3L_N5_AD8N_64) U5.K3(ODT)
DDR4_REFCLK.CLK_N: C25.1
DDR4_REFCLK.CLK_P: C23.1
DDR4_REFCLKC_N: C25.2 R22.1 R24.1 R29.2 U3.AE20(IO_L13N_T2L_N1_GC_QBC_64)
DDR4_REFCLKC_P: C23.2 R21.1 R24.2 R28.2 U3.AD20(IO_L13P_T2L_N0_GC_QBC_64)
DDR4_RESET_B: R3.2 U3.AE26(IO_L1N_T0L_N1_DBC_64) U5.P1(~{RESET_N})
NetC26_1: C26.1 R30.2 R31.2
NetR4_2: R4.2 U3.AF23(IO_T0U_N12_VRP_64)
NetR32_2: R32.2 R36.1 U5.P9(ALERT_N)
NetR33_1: R33.1 U5.T3(PAR)
NetR34_2: R34.2 U5.F9(ZQ)
NetR35_1: R35.1 U3.W18(VREF_64)
NetR48_2: R48.2 U5.N9(TEN)

Not connected (* = marked no-connect by the designer): U5 T7(NC)

### Buses and harness runs
harness DDR4_REFCLK = port DDR4_REFCLK

### Layout directives
differential pair: DDR4_DQS0_N, DDR4_DQS0_P, DDR4_DQS1_N, DDR4_DQS1_P, DDR4_REFCLK.CLK_N, DDR4_REFCLK.CLK_P, DDR4_REFCLKC_N, DDR4_REFCLKC_P

### Notes on the sheet
- DDR4 8Gb 512M x 16
- (near R32) DNI
- (near R33) DNI
- (near R36) DNI
- Addr/Ctrl Termination Resistors
- VTT Bypass Capacitors
- Title
- Size:
- Date:
- A4
- Number:
- Time:
- Revision:
- Sheet
- of
- File:
- (in symbol XCAU10P-1FFVB676I, part D) BANK 64

### Library data of the parts
C18 = CAP CER 10UF 10V X5R 0402: Manufacturer Part Number: CL05A106MP8NUB8; Manufacturer: Samsung Electro-Mechanics; Part #: E-CAP-042; Supplier Part Number 1: 1276-6830-2-ND; Package: 0402; value: 10uF; Supplier 1: Digi-Key; Height: 0.9mm; ComponentLink1Description: New link; ComponentLink1URL: *
C21 = CAP CER 47UF 6.3V X5R 0805: Manufacturer: Samsung; Manufacturer Part Number: CL21A476MQYNNNE; Tolerance: 20%; Supplier 1: Digi-Key; RoHS: Yes; Category: Ceramic Capacitors; Stock 1: 1673694; Pricing 1: 1=0.29000, 10=0.20200, 50=0.13440, 100=0.11420, 500=0.08064, 1000=0.07057 (USD); Mount: Surface Mount; Case/Package: 0805; Case Code (Metric): 2012; Case Code (Imperial): 0805; Contact Plating: Tin; Min Operating Temperature: -55°C; Max Operating Temperature: 85°C; Capacitance: 47uF; Package Quantity: 1; Packaging: Tape and Reel; Dielectric: X5R; Series: CL; Construction: Flat; Length: 2mm; Width: 0.049inch; Height: 1.25mm; Thickness: 0.057inch; Depth: 1.25mm; Radiation Hardening: No; RoHS Compliant: Yes; ComponentLink1URL: https://datasheet.ciiva.com/25791/cl21a476mqynnne-25791153.pdf?src-supplier=Digi-Key; ComponentLink1Description: https://datasheet.ciiva.com/25791/cl21a476mqynnne-25791153.pdf?src-supplier=Digi-Key; ComponentLink2URL: https://datasheet.ciiva.com/26838/getdatasheetpartid-359050-26838632.pdf?src-supplier=Verical; ComponentLink2Description: https://datasheet.ciiva.com/26838/getdatasheetpartid-359050-26838632.pdf?src-supplier=Verical; Supplier Part Number 1: 1276-1852-1-ND
C22 C23 C25 C27-C32 C35 C37 C40 C44 C46 C49 C50 C62 C77-C80 C84 C85 C90 C92 = CAP CER 0.1UF 25V X5R 0402: Manufacturer Part Number: CL05A104KA5NNNC; Manufacturer: Samsung Electro-Mechanics; Supplier Part Number 1: 1276-1043-1-ND; Package: 0402; Height: 0.55mm; Supplier 1: Digi-Key; value: 0.1uF
C26 = CAP CER 0.01uF 50V X7R 0402: CAP CER 10000PF 50V X7R 0402; Manufacturer Part Number: GCM155R71H103KA55D; Manufacturer: Murata Electronics; Supplier Part Number 1: 490-4762-1-ND; Package: 0402; Height: 0.55mm; Supplier 1: Digi-Key; value: 0.01uF
C71 C74-C76 = CAP CER 1UF 25V X5R 0402: Manufacturer Part Number: GRM155R61E105MA12D; Manufacturer: Murata Electronics; Part #: E-CAP-042; Supplier Part Number 1: 490-10018-1-ND; Package: 0402; value: 1uF; Supplier 1: Digi-Key; Height: 0.55mm; ComponentLink1Description: New link; ComponentLink1URL: *
R3 = RES 4.75K OHM 1% 1/16W 0402: Manufacturer: YAGEO; Manufacturer Part Number: RC0402FR-074K75L; Supplier Part Number 1: 311-4.75KLCT-ND; Supplier 1: Digi-Key; Height: 0.4mm; Package: 0402; value: 4.75K
R4 R34 = RES 240 OHM 1% 1/16W 0402: Manufacturer: YAGEO; Manufacturer Part Number: RC0402FR-07240RL; Supplier Part Number 1: 311-240LRCT-ND; Supplier 1: Digi-Key; Height: 0.4mm; Package: 0402; value: 240
R21 R22 R28 R29 = RES 10K OHM 1% 1/16W 0402: Manufacturer: YAGEO; Manufacturer Part Number: RC0402FR-0710KL; Supplier Part Number 1: 311-10.0KLRCT-ND; Package: 0402; Height: 0.4mm; Supplier 1: Digi-Key; value: 10K; Tolerance: ±1%
R24 = RES 100 OHM 1% 1/16W 0402: Manufacturer: YAGEO; Manufacturer Part Number: RC0402FR-07100RL; Supplier Part Number 1: 311-100LRCT-ND; Supplier 1: Digi-Key; Height: 0.4mm; Package: 0402; value: 100
R30 R31 = RES 35.7 OHM 1% 1/16W 0402: Manufacturer: YAGEO; Manufacturer Part Number: RC0402FR-0735R7L; Supplier Part Number 1: YAG3131CT-ND; Supplier 1: Digi-Key; Height: 0.4mm; Package: 0402; value: 35.7
R32 R33 R36 R48 = RES 0 OHM JUMPER 1/16W 0402: Manufacturer: Yageo; Manufacturer Part Number: RC0402JR-070RL; Supplier Part Number 1: 311-0.0JRTR-ND; Package: 0402; Height: 0.4mm; Supplier 1: Digi-Key; value: 0
R35 = RES 1K OHM 1% 1/16W 0402: Manufacturer: YAGEO; Manufacturer Part Number: RC0402FR-071KL; Supplier Part Number 1: 311-1.00KLRCT-ND; Supplier 1: Digi-Key; Height: 0.4mm; Package: 0402; value: 1K
RN1-RN6 = RES ARRAY 4 RES 39 OHM 0804: Res Thick Film Array 39 Ohm 5% ±200ppm/°C ISOL Molded 8-Pin 0804(4 X 0402) Concave SMD T/R; Manufacturer: Panasonic; Manufacturer Part Number: EXB-N8V390JX; Number of Terminals/Pins: 8; Voltage Rating: 50V; Circuit Type: Isolated; Number of Resistors: 4; Power Per Element: 31mW; Voltage Rating (DC): 100V; Supplier 1: Digi-Key; RoHS: Yes; Category: Resistor Arrays; Stock 1: 44825; Pricing 1: 1=0.22000, 10=0.18200, 25=0.13240, 50=0.09600, 100=0.07110, 250=0.05456, 500=0.04300, 1000=0.02977, 5000=0.02481 (USD); Mount: Surface Mount; Case/Package: 0804; Number of Pins: 8; Min Operating Temperature: -55°C; Max Operating Temperature: 125°C; Packaging: Tape and Reel; Resistance: 39R; Tolerance: 5%; Package Quantity: 1; Termination: Concave; Temperature Coefficient: 200ppm/°C; Number of Contacts: 8; Series: EXB; Technology: THICK FILM; Length: 2mm; Width: 0.039inch; Height: 0.45mm; Terminal Pitch: 0.5mm; Depth: 1mm; Radiation Hardening: No; Military Standard: Not; Lead Free: Contains Lead; RoHS Compliant: Yes; ComponentLink1URL: https://datasheet.ciiva.com/3876/41799912s9680473n1386-3876707.pdf?src-supplier=Arrow+Electronics; ComponentLink1Description: https://datasheet.ciiva.com/3876/41799912s9680473n1386-3876707.pdf?src-supplier=Arrow+Electronics; ComponentLink2URL: https://datasheet.ciiva.com/26944/getdatasheetpartid-253340-26944301.pdf?src-supplier=Verical; ComponentLink2Description: https://datasheet.ciiva.com/26944/getdatasheetpartid-253340-26944301.pdf?src-supplier=Verical; ComponentLink3URL: https://datasheet.ciiva.com/19466/1991221-19466954.pdf?src-supplier=Jameco; ComponentLink3Description: https://datasheet.ciiva.com/19466/1991221-19466954.pdf?src-supplier=Jameco; Supplier Part Number 1: Y10390CT-ND
U3 = XCAU10P-1FFVB676I: IC FPGA ARTIXUP 676BGA; Manufacturer: AMD Xilinx; Manufacturer Part Number: XCAU10P-1FFVB676I; Supplier Part Number 1: 122-XCAU10P-1FFVB676I-ND; Supplier 1: Supplier
U5 = MT40A512M16LY-075:E: DRAM Chip DDR4 SDRAM 8Gbit 512Mx16 1.2V 96-Pin FBGA Tray; MF: Micron Technology; Memory Type: Volatile; Memory Size: 8Gb; Frequency: 1.33GHz; MP: MT40A512M16LY-075:E; Package: TFBGA-96 Micron Technology; Price: None; Availability: Unavailable; SnapEDA_Link: https://www.snapeda.com/parts/MT40A512M16LY-075:E/Micron%20Technology%20Inc./view-part/1658163/?ref=snap; Value: *; Supplier 1: Newark; Manufacturer: Micron Technology; Manufacturer Part Number: MT40A512M16LY-075:E; RoHS: Yes; Category: RAM; Stock 1: 277; Pricing 1: 1=13.01000, 10=12.05000, 25=11.78000, 50=11.72000, 100=10.31000, 250=9.80000, 500=9.68000 (USD); Min Operating Temperature: 0°C; Max Operating Temperature: 95°C; RoHS Compliant: Yes; ComponentLink1URL: https://www.micron.com/~/media/documents/products/data-sheet/dram/ddr4/8gb_ddr4_sdram.pdf?src-supplier=Digi-Key; ComponentLink1Description: https://www.micron.com/~/media/documents/products/data-sheet/dram/ddr4/8gb_ddr4_sdram.pdf?src-supplier=Digi-Key; Supplier Part Number 1: 83AH2723